# EAGLE design pentawallMini (EAGLE 5.11)
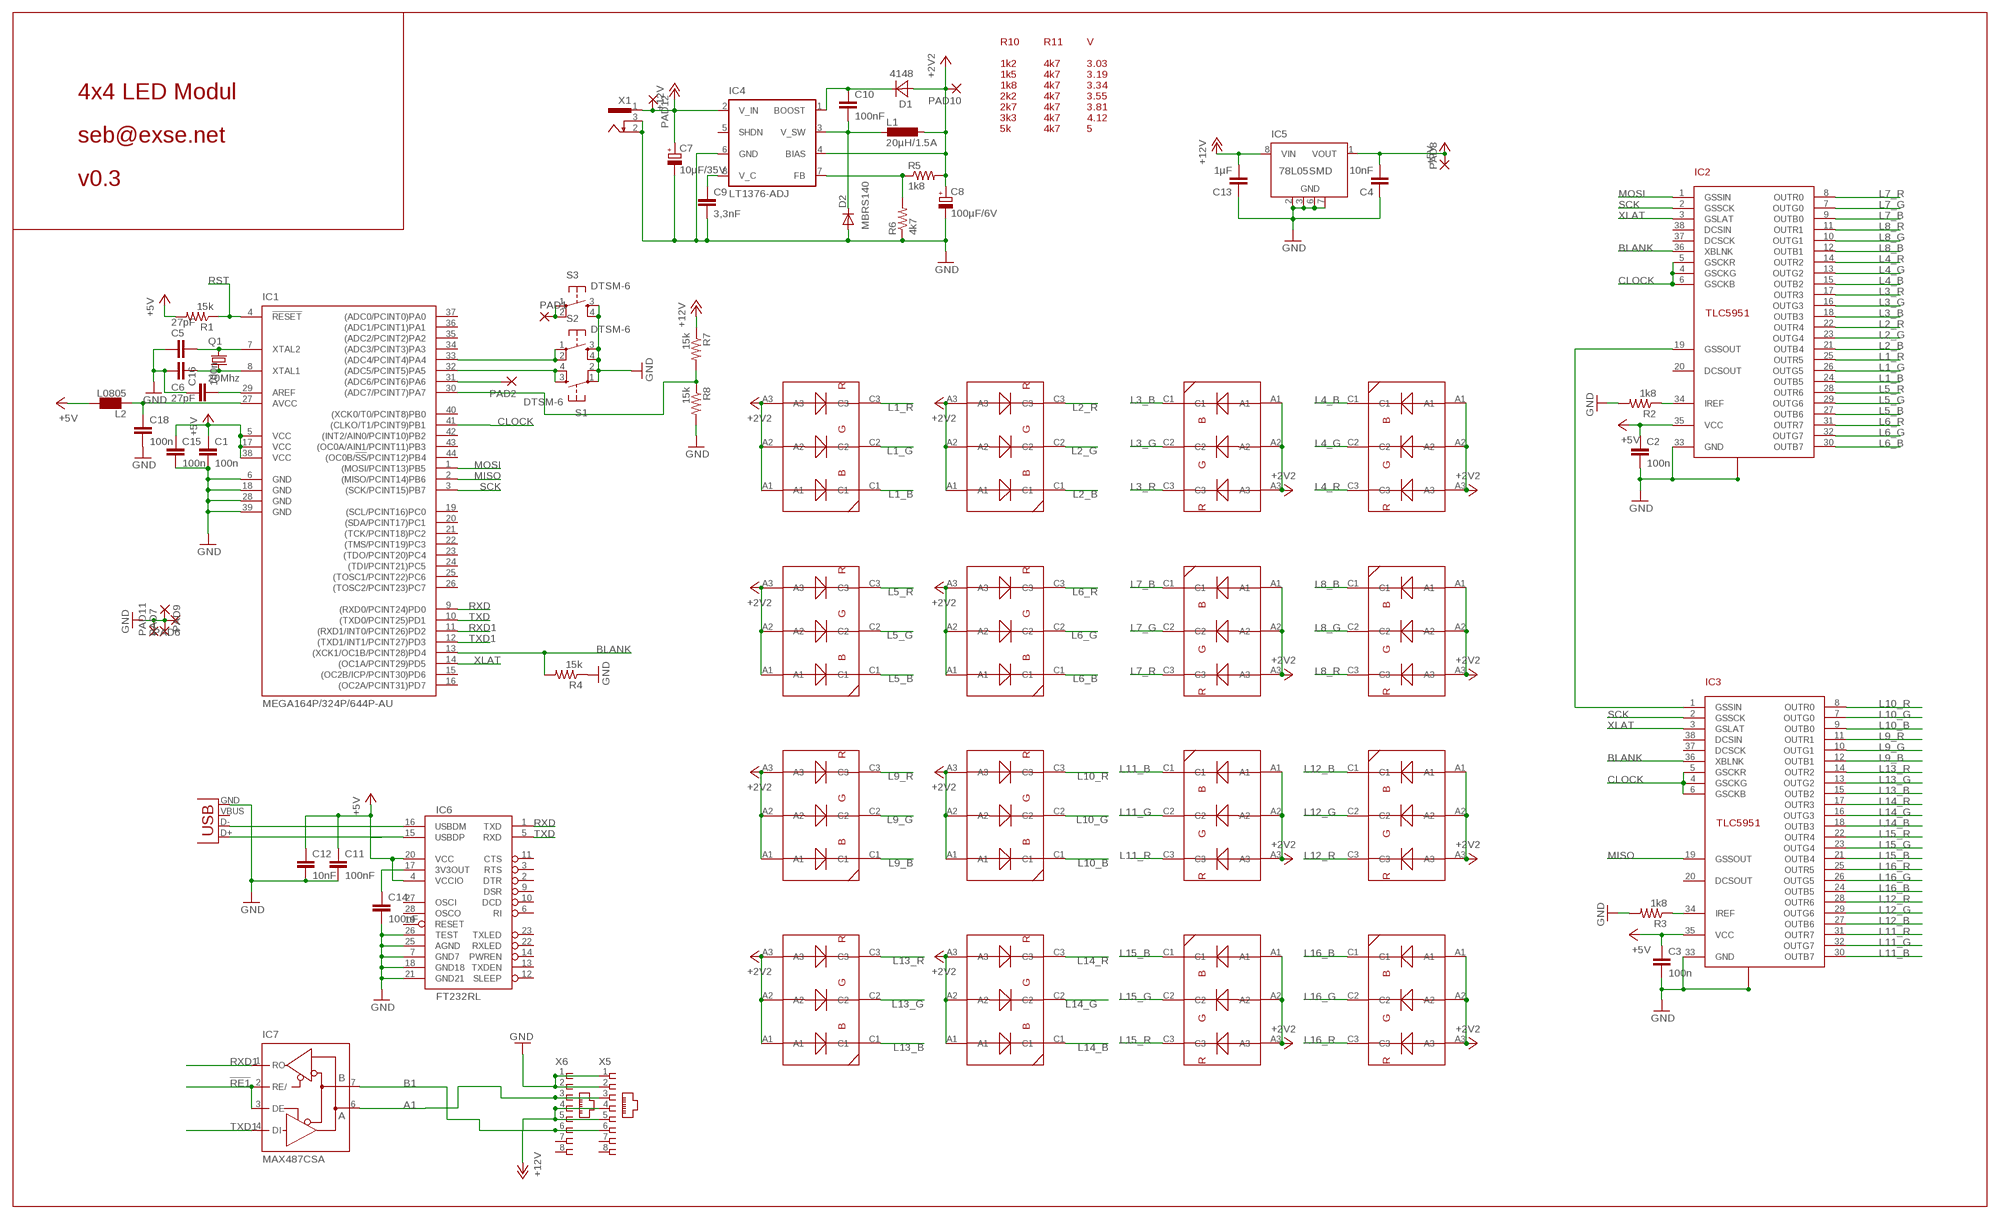
[diagram p0: schematic, sheet 1]

## Parts
C1  100n  CAP0805  [0805]
C2  100n  CAP0805  [0805]
C3  100n  CAP0805  [0805]
C4  10nF  CAP0805  [0805]
C5  27pF  CAP0805  [0805]
C6  27pF  CAP0805  [0805]
C7  10µF/35V  CPOL-EUSMCD  [SMC_D]
C8  100µF/6V  CPOL-EUSMCD  [SMC_D]
C9  3,3nF  CAP0805  [0805]
C10  100nF  CAP0805  [0805]
C11  100nF  CAP0805  [0805]
C12  10nF  CAP0805  [0805]
C13  1µF  CAP0805  [0805]
C14  100nF  CAP0805  [0805]
C15  100n  CAP0805  [0805]
C16  100n  CAP0805  [0805]
C18  100n  CAP0805  [0805]
D1  4148  DIODE_0805  [DIODE_0805]
D2  MBRS140  DIODE-SMB  [SMB]
IC1  MEGA164P/324P/644P-AU  [TQFP44]
IC2  TLC5951  [POWERPAD38]
IC3  TLC5951  [POWERPAD38]
IC4  LT1376-ADJ  LT1376  [SO-08]
IC5  78L05SMD  [SO08]
IC6  FT232RL  FT232RLSSOP  [SSOP28DB]
IC7  MAX487CSA  MAX481CSA  [SO08]
L1  20µH/1.5A  DO3316P  [DO3316P]
L2  L0805  [0805]
PAD1  SMD2  [SMD1,27-2,54]
PAD2  SMD2  [SMD1,27-2,54]
PAD6  SMD2  [SMD1,27-2,54]
PAD7  SMD2  [SMD1,27-2,54]
PAD8  SMD2  [SMD1,27-2,54]
PAD9  SMD2  [SMD1,27-2,54]
PAD10  SMD2  [SMD1,27-2,54]
PAD11  SMD2  [SMD1,27-2,54]
PAD12  SMD2  [SMD1,27-2,54]
Q1  20Mhz  X22-OSCILLATOR  [X22]
R1  15k  RESISTOR  [0805]
R2  1k8  RESISTOR  [0805]
R3  1k8  RESISTOR  [0805]
R4  15k  RESISTOR  [0805]
R5  1k8  RESISTOR  [0805]
R6  4k7  RESISTOR  [0805]
R7  15k  RESISTOR  [0805]
R8  15k  RESISTOR  [0805]
S1  DTSM-6  [DTSM-6]
S2  DTSM-6  [DTSM-6]
S3  DTSM-6  [DTSM-6]
U$1  OSRAM_LRTB_GFTG  OSRAM_LRTB_GFTGSMALL  [PLCC-6_SMALL]
U$2  OSRAM_LRTB_GFTG  OSRAM_LRTB_GFTGSMALL  [PLCC-6_SMALL]
U$3  OSRAM_LRTB_GFTG  OSRAM_LRTB_GFTGSMALL  [PLCC-6_SMALL]
U$4  OSRAM_LRTB_GFTG  OSRAM_LRTB_GFTGSMALL  [PLCC-6_SMALL]
U$5  OSRAM_LRTB_GFTG  OSRAM_LRTB_GFTGSMALL  [PLCC-6_SMALL]
U$6  OSRAM_LRTB_GFTG  OSRAM_LRTB_GFTGSMALL  [PLCC-6_SMALL]
U$7  OSRAM_LRTB_GFTG  OSRAM_LRTB_GFTGSMALL  [PLCC-6_SMALL]
U$8  OSRAM_LRTB_GFTG  OSRAM_LRTB_GFTGSMALL  [PLCC-6_SMALL]
U$9  OSRAM_LRTB_GFTG  OSRAM_LRTB_GFTGSMALL  [PLCC-6_SMALL]
U$10  OSRAM_LRTB_GFTG  OSRAM_LRTB_GFTGSMALL  [PLCC-6_SMALL]
U$11  OSRAM_LRTB_GFTG  OSRAM_LRTB_GFTGSMALL  [PLCC-6_SMALL]
U$12  OSRAM_LRTB_GFTG  OSRAM_LRTB_GFTGSMALL  [PLCC-6_SMALL]
U$13  OSRAM_LRTB_GFTG  OSRAM_LRTB_GFTGSMALL  [PLCC-6_SMALL]
U$14  OSRAM_LRTB_GFTG  OSRAM_LRTB_GFTGSMALL  [PLCC-6_SMALL]
U$15  OSRAM_LRTB_GFTG  OSRAM_LRTB_GFTGSMALL  [PLCC-6_SMALL]
U$16  OSRAM_LRTB_GFTG  OSRAM_LRTB_GFTGSMALL  [PLCC-6_SMALL]
X1  733980-62  [733980-62]
X2  USB-SMD-NS  [USB-MINIB-NOSTOP]
X5  RJ45-8L-B  [RJ45-NO-SHIELD]
X6  RJ45-8L-B  [RJ45-NO-SHIELD]

## Nets
!RE1: IC7.2(RE/) IC7.3(DE)
+12V: C7.+ C13.2 IC4.2(V_IN) IC5.8(VIN) PAD12.1(P) R7.1 X1.1
+24V: X5.4 X5.5 X6.4 X6.5 ; supply symbol labelled +12V
A1: IC7.6(A) X5.3 X6.3
B1: IC7.7(B) X5.6 X6.6
BLANK: IC1.13((XCK1/OC1B/PCINT28)PD4) IC2.36(XBLNK) IC3.36(XBLNK) R4.2
CLOCK: IC1.41((CLKO/T1/PCINT9)PB1) IC2.4(GSCKG) IC2.5(GSCKR) IC2.6(GSCKB) IC3.4(GSCKG) IC3.5(GSCKR) IC3.6(GSCKB)
DVCC: C1.1 C2.1 C3.1 C4.2 C11.1 C12.1 C15.1 IC1.5(VCC) IC1.17(VCC) IC1.38(VCC) IC2.35(VCC) IC3.35(VCC) IC5.1(VOUT) IC6.4(VCCIO) IC6.20(VCC) L2.1 PAD8.1(P) R1.2 ; supply symbol labelled +5V
GND: C1.2 C2.2 C3.2 C4.1 C5.1 C6.1 C7.- C8.- C9.2 C11.2 C12.2 C13.1 C14.2 C15.2 C16.1 C18.2 D2.A IC1.6(GND) IC1.18(GND) IC1.28(GND) IC1.39(GND) IC2.33(GND) IC2.FND@10(GND) IC2.GND IC2.GND@1(GND) IC2.GND@2(GND) IC2.GND@3(GND) IC2.GND@4(GND) IC2.GND@5(GND) IC2.GND@6(GND) IC2.GND@7(GND) IC2.GND@8(GND) IC2.GND@9(GND) IC2.GND@11(GND) IC2.GND@12(GND) IC2.GND@13(GND) IC2.GND@14(GND) IC2.GND@15(GND) IC2.GND@16(GND) IC2.GND@17(GND) IC2.GND@18(GND) IC2.GND@19(GND) IC2.GND@20(GND) IC2.GND@21(GND) IC2.GND@22(GND) IC2.GND@23(GND) IC2.GND@24(GND) IC2.GND@25(GND) IC2.GND@26(GND) IC2.GND@27(GND) IC2.GND@28(GND) IC2.GND@29(GND) IC2.GND@30(GND) IC2.GND@31(GND) IC2.GND@32(GND) IC2.GND@33(GND) IC2.GND@34(GND) IC2.GND@35(GND) IC2.GND@36(GND) IC2.GND@37(GND) IC2.GND@38(GND) IC2.GND@39(GND) IC2.GND@40(GND) IC2.GND@41(GND) IC3.33(GND) IC3.FND@10(GND) IC3.GND IC3.GND@1(GND) IC3.GND@2(GND) IC3.GND@3(GND) IC3.GND@4(GND) IC3.GND@5(GND) IC3.GND@6(GND) IC3.GND@7(GND) IC3.GND@8(GND) IC3.GND@9(GND) IC3.GND@11(GND) IC3.GND@12(GND) IC3.GND@13(GND) IC3.GND@14(GND) IC3.GND@15(GND) IC3.GND@16(GND) IC3.GND@17(GND) IC3.GND@18(GND) IC3.GND@19(GND) IC3.GND@20(GND) IC3.GND@21(GND) IC3.GND@22(GND) IC3.GND@23(GND) IC3.GND@24(GND) IC3.GND@25(GND) IC3.GND@26(GND) IC3.GND@27(GND) IC3.GND@28(GND) IC3.GND@29(GND) IC3.GND@30(GND) IC3.GND@31(GND) IC3.GND@32(GND) IC3.GND@33(GND) IC3.GND@34(GND) IC3.GND@35(GND) IC3.GND@36(GND) IC3.GND@37(GND) IC3.GND@38(GND) IC3.GND@39(GND) IC3.GND@40(GND) IC3.GND@41(GND) IC4.6(GND) IC5.2(GND) IC5.3(GND) IC5.6(GND) IC5.7(GND) IC6.7(GND7) IC6.18(GND18) IC6.21(GND21) IC6.25(AGND) IC6.26(TEST) PAD6.1(P) PAD7.1(P) PAD9.1(P) PAD11.1(P) R2.2 R3.2 R4.1 R6.1 R8.2 S1.1 S1.2 S2.3 S2.4 S3.3 S3.4 X1.2 X1.3 X2.GND X5.1 X5.2 X6.1 X6.2
L1_B: IC2.24(OUTB5) U$8.C1
L1_G: IC2.26(OUTG5) U$8.C2
L1_R: IC2.25(OUTR5) U$8.C3
L2_B: IC2.21(OUTB4) U$7.C1
L2_G: IC2.23(OUTG4) U$7.C2
L2_R: IC2.22(OUTR4) U$7.C3
L3_B: IC2.18(OUTB3) U$1.C1
L3_G: IC2.16(OUTG3) U$1.C2
L3_R: IC2.17(OUTR3) U$1.C3
L4_B: IC2.15(OUTB2) U$3.C1
L4_G: IC2.13(OUTG2) U$3.C2
L4_R: IC2.14(OUTR2) U$3.C3
L5_B: IC2.27(OUTB6) U$2.C1
L5_G: IC2.29(OUTG6) U$2.C2
L5_R: IC2.28(OUTR6) U$2.C3
L6_B: IC2.30(OUTB7) U$10.C1
L6_G: IC2.32(OUTG7) U$10.C2
L6_R: IC2.31(OUTR7) U$10.C3
L7_B: IC2.9(OUTB0) U$6.C1
L7_G: IC2.7(OUTG0) U$6.C2
L7_R: IC2.8(OUTR0) U$6.C3
L8_B: IC2.12(OUTB1) U$9.C1
L8_G: IC2.10(OUTG1) U$9.C2
L8_R: IC2.11(OUTR1) U$9.C3
L9_B: IC3.12(OUTB1) U$14.C1
L9_G: IC3.10(OUTG1) U$14.C2
L9_R: IC3.11(OUTR1) U$14.C3
L10_B: IC3.9(OUTB0) U$13.C1
L10_G: IC3.7(OUTG0) U$13.C2
L10_R: IC3.8(OUTR0) U$13.C3
L11_B: IC3.30(OUTB7) U$12.C1
L11_G: IC3.32(OUTG7) U$12.C2
L11_R: IC3.31(OUTR7) U$12.C3
L12_B: IC3.27(OUTB6) U$5.C1
L12_G: IC3.29(OUTG6) U$5.C2
L12_R: IC3.28(OUTR6) U$5.C3
L13_B: IC3.15(OUTB2) U$11.C1
L13_G: IC3.13(OUTG2) U$11.C2
L13_R: IC3.14(OUTR2) U$11.C3
L14_B: IC3.18(OUTB3) U$15.C1
L14_G: IC3.16(OUTG3) U$15.C2
L14_R: IC3.17(OUTR3) U$15.C3
L15_B: IC3.21(OUTB4) U$16.C1
L15_G: IC3.23(OUTG4) U$16.C2
L15_R: IC3.22(OUTR4) U$16.C3
L16_B: IC3.24(OUTB5) U$4.C1
L16_G: IC3.26(OUTG5) U$4.C2
L16_R: IC3.25(OUTR5) U$4.C3
MISO: IC1.2((MISO/PCINT14)PB6) IC3.19(GSSOUT)
MOSI: IC1.1((MOSI/PCINT13)PB5) IC2.1(GSSIN)
N$1: IC6.16(USBDM) X2.D-
N$2: IC1.33((ADC4/PCINT4)PA4) S2.1 S2.2
N$3: IC6.15(USBDP) X2.D+
N$4: C16.2 IC1.29(AREF)
N$5: C18.1 IC1.27(AVCC) L2.2
N$7: IC1.32((ADC5/PCINT5)PA5) S1.3 S1.4
N$9: IC2.19(GSSOUT) IC3.1(GSSIN)
N$10: IC4.7(FB) R5.1 R6.2
N$11: IC3.34(IREF) R3.1
N$12: IC2.34(IREF) R2.1
N$14: PAD1.1(P) S3.1 S3.2
N$15: IC1.31((ADC6/PCINT6)PA6) PAD2.1(P)
N$16: IC1.30((ADC7/PCINT7)PA7) R7.2 R8.1
N$29: C14.1 IC6.17(3V3OUT)
N$30: C5.2 IC1.7(XTAL2) Q1.3
N$32: C6.2 IC1.8(XTAL1) Q1.1
N$56: C9.1 IC4.8(V_C)
N$57: C10.2 D2.C IC4.3(V_SW) L1.1
N$58: C10.1 D1.1(C) IC4.1(BOOST)
RST: IC1.4(!RESET) R1.1
RXD: IC1.9((RXD0/PCINT24)PD0) IC6.1(TXD)
RXD1: IC1.11((RXD1/INT0/PCINT26)PD2) IC7.1(RO)
SCK: IC1.3((SCK/PCINT15)PB7) IC2.2(GSSCK) IC3.2(GSSCK)
TXD: IC1.10((TXD0/PCINT25)PD1) IC6.5(RXD)
TXD1: IC1.12((TXD1/INT1/PCINT27)PD3) IC7.4(DI)
VCC_R: C8.+ D1.2(A) IC4.4(BIAS) L1.2 PAD10.1(P) R5.2 U$1.A1 U$1.A2 U$1.A3 U$2.A1 U$2.A2 U$2.A3 U$3.A1 U$3.A2 U$3.A3 U$4.A1 U$4.A2 U$4.A3 U$5.A1 U$5.A2 U$5.A3 U$6.A1 U$6.A2 U$6.A3 U$7.A1 U$7.A2 U$7.A3 U$8.A1 U$8.A2 U$8.A3 U$9.A1 U$9.A2 U$9.A3 U$10.A1 U$10.A2 U$10.A3 U$11.A1 U$11.A2 U$11.A3 U$12.A1 U$12.A2 U$12.A3 U$13.A1 U$13.A2 U$13.A3 U$14.A1 U$14.A2 U$14.A3 U$15.A1 U$15.A2 U$15.A3 U$16.A1 U$16.A2 U$16.A3 ; supply symbol labelled +2V2
XLAT: IC1.14((OC1A/PCINT29)PD5) IC2.3(GSLAT) IC3.3(GSLAT)
Unconnected: IC1.15((OC2B/ICP/PCINT30)PD6) IC1.16((OC2A/PCINT31)PD7) IC1.19((SCL/PCINT16)PC0) IC1.20((SDA/PCINT17)PC1) IC1.21((TCK/PCINT18)PC2) IC1.22((TMS/PCINT19)PC3) IC1.23((TDO/PCINT20)PC4) IC1.24((TDI/PCINT21)PC5) IC1.25((TOSC1/PCINT22)PC6) IC1.26((TOSC2/PCINT23)PC7) IC1.34((ADC3/PCINT3)PA3) IC1.35((ADC2/PCINT2)PA2) IC1.36((ADC1/PCINT1)PA1) IC1.37((ADC0/PCINT0)PA0) IC1.40((XCK0/T0/PCINT8)PB0) IC1.42((INT2/AIN0/PCINT10)PB2) IC1.43((OC0A/AIN1/PCINT11)PB3) IC1.44((OC0B/!SS!/PCINT12)PB4) IC2.20(DCSOUT) IC2.37(DCSCK) IC2.38(DCSIN) IC3.20(DCSOUT) IC3.37(DCSCK) IC3.38(DCSIN) IC4.5(SHDN) IC5.4(NC) IC5.5(NC) IC6.2(DTR) IC6.3(RTS) IC6.6(RI) IC6.9(DSR) IC6.10(DCD) IC6.11(CTS) IC6.12(SLEEP) IC6.13(TXDEN) IC6.14(PWREN) IC6.19(RESET) IC6.22(RXLED) IC6.23(TXLED) IC6.27(OSCI) IC6.28(OSCO) X2.VBUS X5.7 X5.8 X6.7 X6.8

## Notes on the sheet
- R10 | R11 | V
- 1k2 | 4k7 | 3.03
- 1k5 | 4k7 | 3.19
- 1k8 | 4k7 | 3.34
- 4x4 LED Modul | 2k2 | 4k7 | 3.55
- 2k7 | 4k7 | 3.81
- 3k3 | 4k7 | 4.12
- 5k | 4k7 | 5
- seb@exse.net
- v0.3

## Power pins joined to a net without a drawn wire
GND: IC7.5(GND)
VCC: IC7.8(VCC)

## Library data of the parts
C1-C6 C9-C16 C18 = SparkFun:CAP: Capacitor Standard 0603 ceramic capacitor, and 0.1" leaded capacitor.
C7 C8 = resistor:CPOL-EU: POLARIZED CAPACITOR, European symbol
D1 = seb:DIODE_0805
D2 = diode:DIODE-: DIODE
IC1 = avr-7:MEGA164P/324P/644P-AU
IC2 IC3 = seb:TLC5951
IC4 = v-reg:LT1376
IC5 = linear:78L*SMD: Positive VOLTAGE REGULATOR
IC6 = SparkFun:FT232RL: USB UART FT232RL 4th Generation USB UART (USB <-> Serial) Controller. Spark Fun Electronics SKU : COM-00650
IC7 = maxim:MAX481CSA: RS485 TRANSEIVER
L1 = inductor-coilcraft:DO3316P: COILCRAFT; OC_FARNELL: unknown; OC_NEWARK: unknown
L2 = seb:L0805
PAD1 PAD2 PAD6-PAD12 = wirepad:SMD2: SMD PAD
Q1 = seb:X22-OSCILLATOR
R1-R8 = SparkFun:RESISTOR: Resistor Basic schematic elements and footprints for 0603, 1206, and PTH 1/10th watt (small) resistors.
S1-S3 = switch-tact:DTSM-6
U$1-U$16 = seb:OSRAM_LRTB_GFTG
X1 = con-conrad:73398?: FEMALE PRINT CONNECTOR Niedervolt-Steckverbinder Distributor Conrad
X2 = SparkFun:USB: USB Connectors USB-B-PTH is fully proven SKU : PRT-00139 USB-miniB is fully proven SKU : PRT-00587 USB-A-PCB is untested. USB-A-H is throughly reviewed, but untested. Spark Fun Electronics SKU : PRT-00437 USB-B-SMT is throughly reviewed, but untested. Needs silkscreen touching up. USB-A-S has not been used/tested USB-MB-H has not been used/tested
X5 X6 = con-tycoelectronics:RJ45: CORCOM Modular RJ Jacks No Shield Source: www.tycoelectronics.com .. ENG_DS_1654001_1099_RJ_L_0507.pdf; MF: TYCO ELECTRONICS; MPN: RJ45-8L-B; OC_FARNELL: 1279843; OC_NEWARK: 52K4445

## Board
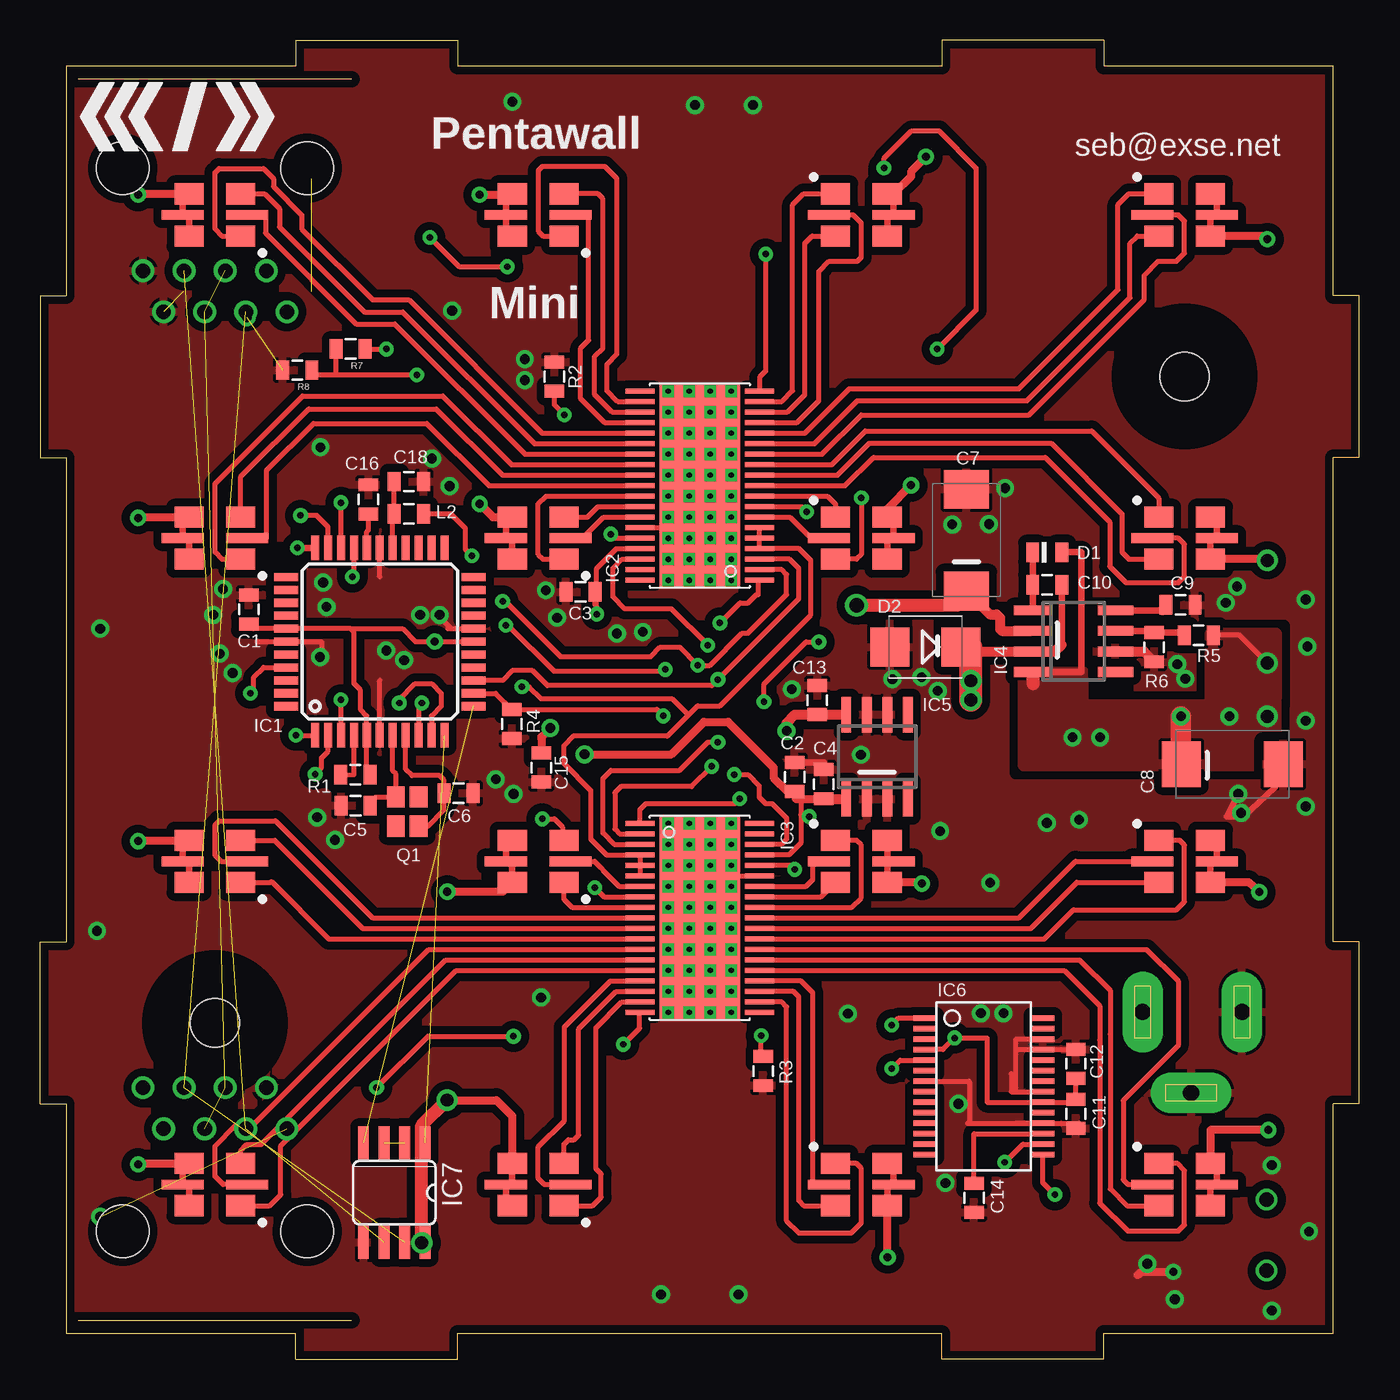
[diagram p1: board, top side]
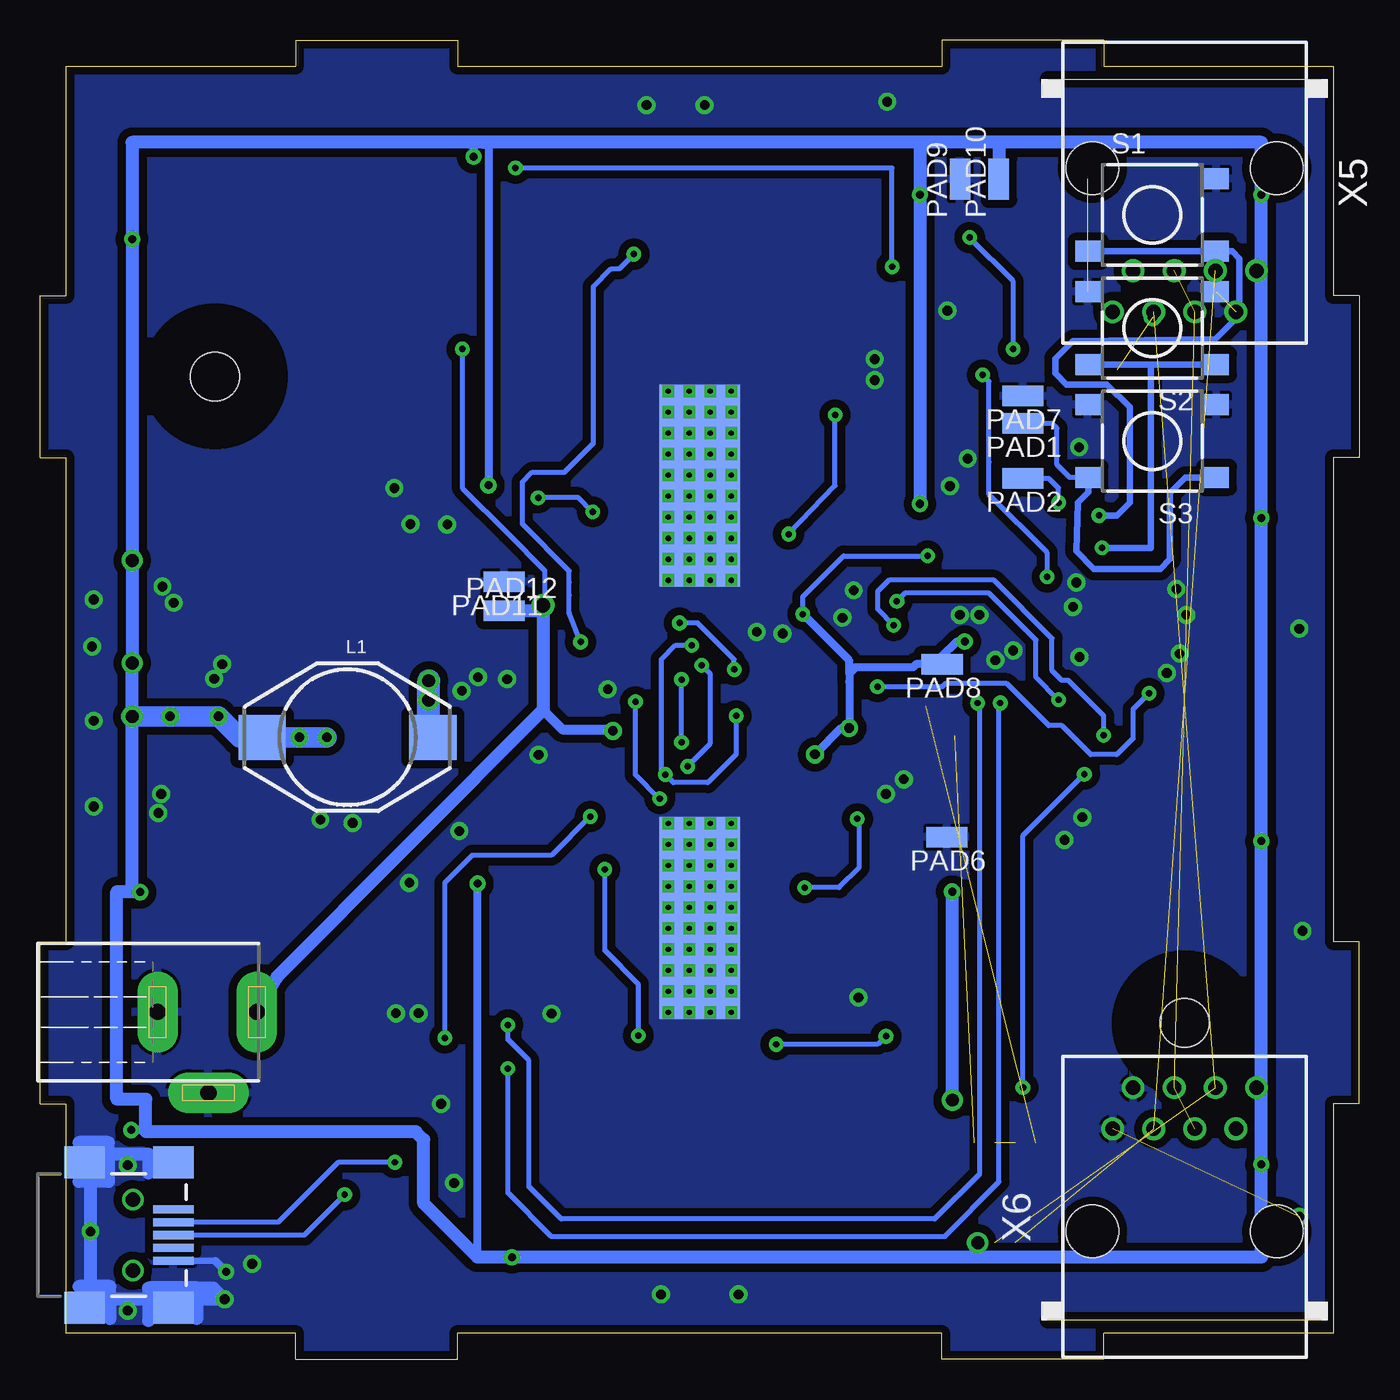
[diagram p2: board, bottom side, seen from below]

Size 81.6 x 81.6 mm. Coordinates in mm from the lower left corner, seen from the top.
Outline: 80,1.6 80,15.8 81.6,15.8 81.6,25.8 80,25.8 80,55.8 81.6,55.8 81.6,65.8 80,65.8 80,80 65.8,80 65.8,81.6 55.8,81.6 55.8,80 25.8,80 25.8,81.6 15.8,81.6 15.8,80 1.6,80 1.6,65.8 0,65.8 0,55.8 1.6,55.8 1.6,25.8 0,25.8 0,15.8 1.6,15.8 1.6,1.6 15.8,1.6 15.8,0 25.8,0 25.8,1.6 55.8,1.6 55.8,0 65.8,0 65.8,1.6 80,1.6
Copper layers (1*16): Top 0.035mm / dielectric 1.5mm / Bottom 0.035mm
Design rules "PCBCart-Standard *": minimum track width 12mil, minimum drill 0.3mm, track to track 13mil, track to pad 12mil, pad to pad 9mil, via to via 13mil, smd to smd 8mil, copper to edge 20mil, drill to drill 8mil, minimum pad ring 8mil, minimum via ring 10mil, stop-mask expansion 2mil, vias tented up to drill 2mm, thermal gap 8mil
Holes 3 mm at 10.8,20.8 70.8,60.8
tRestrict: area 69.8,59.8 to 71.8,61.8; area 9.8,19.8 to 11.8,21.8
bRestrict: area 69.8,59.8 to 71.8,61.8; area 9.8,19.8 to 11.8,21.8

### Footprints (pad centres in the part's own frame; a part is rotated, then mirrored left to right if it is on the bottom)
0805 = smd 0.8 x 1.2: 1 -0.9,0; 2 0.9,0
SMC_D = smd 2.4 x 2.8: + -3.15,0; - 3.15,0
DIODE_0805 = smd 0.8 x 1.2: 1 -0.9,0; 2 0.9,0
SMB = smd 2.4 x 2.4: A 2.2,0; C -2.2,0
TQFP44 = smd 1.5 x 0.5: 1 -5.8,4; 2 -5.8,3.2; 3 -5.8,2.4; 4 -5.8,1.6; 5 -5.8,0.8; 6 -5.8,0; 7 -5.8,-0.8; 8 -5.8,-1.6; 9 -5.8,-2.4; 10 -5.8,-3.2; 11 -5.8,-4; 23 5.8,-4; 24 5.8,-3.2; 25 5.8,-2.4; 26 5.8,-1.6; 27 5.8,-0.8; 28 5.8,0; 29 5.8,0.8; 30 5.8,1.6; 31 5.8,2.4; 32 5.8,3.2; 33 5.8,4 | smd 0.5 x 1.5: 12 -4,-5.8; 13 -3.2,-5.8; 14 -2.4,-5.8; 15 -1.6,-5.8; 16 -0.8,-5.8; 17 0,-5.8; 18 0.8,-5.8; 19 1.6,-5.8; 20 2.4,-5.8; 21 3.2,-5.8; 22 4,-5.8; 34 4,5.8; 35 3.2,5.8; 36 2.4,5.8; 37 1.6,5.8; 38 0.8,5.8; 39 0,5.8; 40 -0.8,5.8; 41 -1.6,5.8; 42 -2.4,5.8; 43 -3.2,5.8; 44 -4,5.8
POWERPAD38 = smd 0.305 x 1.8: 1 -5.85,-3.7; 2 -5.2,-3.7; 3 -4.55,-3.7; 4 -3.9,-3.7; 5 -3.25,-3.7; 6 -2.6,-3.7; 7 -1.95,-3.7; 8 -1.3,-3.7; 9 -0.65,-3.7; 10 0,-3.7; 11 0.65,-3.7; 12 1.3,-3.7; 13 1.95,-3.7; 14 2.6,-3.7; 15 3.25,-3.7; 16 3.9,-3.7; 17 4.55,-3.7; 18 5.2,-3.7; 19 5.85,-3.7; 20 5.85,3.7; 21 5.2,3.7; 22 4.55,3.7; 23 3.9,3.7; 24 3.25,3.7; 25 2.6,3.7; 26 1.95,3.7; 27 1.3,3.7; 28 0.65,3.7; 29 0,3.7; 30 -0.65,3.7; 31 -1.3,3.7; 32 -1.95,3.7; 33 -2.6,3.7; 34 -3.25,3.7; 35 -3.9,3.7; 36 -4.55,3.7; 37 -5.2,3.7; 38 -5.85,3.7 | drill 0.33 square: FND@10 5.85,1.95; GND@1 -5.85,1.95; GND@2 -4.55,1.95; GND@3 -3.25,1.95; GND@4 -1.95,1.95; GND@5 -0.65,1.95; GND@6 0.65,1.95; GND@7 1.95,1.95; GND@8 3.25,1.95; GND@9 4.55,1.95; GND@11 -5.85,0.65; GND@12 -4.55,0.65; GND@13 -3.25,0.65; GND@14 -1.95,0.65; GND@15 -0.65,0.65; GND@16 0.65,0.65; GND@17 1.95,0.65; GND@18 3.25,0.65; GND@19 4.55,0.65; GND@20 5.85,0.65; GND@21 -5.85,-0.65; GND@22 -4.55,-0.65; GND@23 -3.25,-0.65; GND@24 -1.95,-0.65; GND@25 -0.65,-0.65; GND@26 0.65,-0.65; GND@27 1.95,-0.65; GND@28 3.25,-0.65; GND@29 4.55,-0.65; GND@30 5.85,-0.65; GND@31 -5.85,-1.95; GND@32 -4.55,-1.95; GND@33 -3.25,-1.95; GND@34 -1.95,-1.95; GND@35 -0.65,-1.95; GND@36 0.65,-1.95; GND@37 1.95,-1.95; GND@38 3.25,-1.95; GND@39 4.55,-1.95; GND@40 5.85,-1.95 | smd 12.5 x 5: GND 0,0 | smd 12.5 x 5 bottom: GND@41 0,0
SO-08 = smd 0.6 x 2.2: 1 -1.905,-2.6; 2 -0.635,-2.6; 3 0.635,-2.6; 4 1.905,-2.6; 5 1.905,2.6; 6 0.635,2.6; 7 -0.635,2.6; 8 -1.905,2.6
SO08 = smd 0.6 x 2.2: 1 -1.905,-2.6; 2 -0.635,-2.6; 3 0.635,-2.6; 4 1.905,-2.6; 5 1.905,2.6; 6 0.635,2.6; 7 -0.635,2.6; 8 -1.905,2.6
SSOP28DB = smd 0.348 x 1.397: 1 -4.225,-3.656; 2 -3.575,-3.656; 3 -2.925,-3.656; 4 -2.275,-3.656; 5 -1.625,-3.656; 6 -0.975,-3.656; 7 -0.325,-3.656; 8 0.325,-3.656; 9 0.975,-3.656; 10 1.625,-3.656; 11 2.275,-3.656; 12 2.925,-3.656; 13 3.575,-3.656; 14 4.225,-3.656; 15 4.225,3.656; 16 3.575,3.656; 17 2.925,3.656; 18 2.275,3.656; 19 1.625,3.656; 20 0.975,3.656; 21 0.325,3.656; 22 -0.325,3.656; 23 -0.975,3.656; 24 -1.625,3.656; 25 -2.275,3.656; 26 -2.925,3.656; 27 -3.575,3.656; 28 -4.225,3.656
SO08' = smd 0.66 x 2.032: 1 -1.905,-3.073; 2 -0.635,-3.073; 3 0.635,-3.073; 4 1.905,-3.073; 5 1.905,3.073; 6 0.635,3.073; 7 -0.635,3.073; 8 -1.905,3.073
DO3316P = smd 2.92 x 2.79: 1 -5.28,0; 2 5.28,0
SMD1,27-2,54 = smd 1.27 x 2.54: 1 0,0
X22 = smd 1.3 x 1.1: 1 0.9,0.7; 2 -0.9,0.7; 3 -0.9,-0.7; 4 0.9,-0.7
DTSM-6 = smd 1.55 x 1.3: 1 -3.975,2.25; 2 3.975,2.25; 3 -3.975,-2.25; 4 3.975,-2.25
PLCC-6_SMALL = smd 1.3 x 1.8: A1 1.3,-1.6; A3 -1.3,-1.6; C1 1.3,1.6; C3 -1.3,1.6 | smd 0.6 x 2.6: A2 0,-2; C2 0,2
733980-62 = drill 1 pad 2.5 long: 1 0,8.57; 2 0,2.42; 3 5,5.57
USB-MINIB-NOSTOP = smd 2.5 x 0.5: D+ 2.5,0; D- 2.5,0.8; GND 2.5,-1.6; ID 2.5,-0.8; VBUS 2.5,1.6 | smd 2.5 x 2: G1 -3,-4.5; G2 -3,4.5; G3 2.5,4.5; G4 2.5,-4.5 | drill 0.9 pad 0.8 round: H1 0,2.2 | drill 0.9 pad 0.787 round: H2 0,-2.2
RJ45-NO-SHIELD = drill 0.9 pad 1.4 round: 1 -4.445,6.35; 2 -3.175,8.89; 3 -1.905,6.35; 4 -0.635,8.89; 5 0.635,6.35; 6 1.905,8.89; 7 3.175,6.35; 8 4.445,8.89 | hole 3.251: -5.715,0; 5.715,0

### Placement (x,y rotation side)
C1  12.9,46.39 90 top
C2  46.67,36.02 90 top
C3  33.42,47.47 180 top
C4  48.47,35.57 270 top
C5  19.5,34.25 0 top
C6  25.88,35.02 180 top
C7  57.3,50.67 90 top
C8  73.75,36.81 0 top
C9  70.55,46.67 0 top
C10  62.3,47.92 0 top
C11  64.08,15.18 270 top
C12  64.08,18.28 90 top
C13  48.07,40.77 270 top
C14  57.77,9.98 270 top
C15  31,36.6 270 top
C16  20.3,53.2 270 top
C18  22.8,54.3 0 top
D1  62.3,49.92 0 top
D2  54.76,44.06 180 top
IC1  21,44.4 90 top
IC2  40.8,54.05 90 top
IC3  40.8,27.3 270 top
IC4  63.92,44.42 270 top
IC5  51.77,37.27 0 top
IC6  58.38,16.88 270 top
IC7  MAX487CSA  [SO08']  21.9,10.3 180 top
L1  62.6,38.47 180 bottom
L2  22.8,52.3 180 top
PAD1  20.8,57.9 90 bottom
PAD2  20.8,54.5 90 bottom
PAD6  25.5,32.3 90 bottom
PAD7  20.8,59.6 90 bottom
PAD8  25.8,43 90 bottom
PAD9  24.7,73 0 bottom
PAD10  22.3,73 0 bottom
PAD11  52.9,48.1 90 bottom
PAD12  52.9,46.3 270 bottom
Q1  22.7,33.88 270 top
R1  19.49,36.16 0 top
R2  31.8,60.8 90 top
R3  44.72,17.82 270 top
R4  29.18,39.3 90 top
R5  71.67,44.8 0 top
R6  68.92,44.05 90 top
R7  19.2,62.5 180 top
R8  15.9,61.2 180 top
S1  12.8,70.8 0 bottom
S2  12.8,63.8 180 bottom
S3  12.8,56.8 180 bottom
U$1  50.8,70.8 90 top
U$2  10.8,50.8 270 top
U$3  70.8,70.8 90 top
U$4  70.8,10.8 90 top
U$5  70.8,30.8 90 top
U$6  50.8,50.8 90 top
U$7  30.8,70.8 270 top
U$8  10.8,70.8 270 top
U$9  70.8,50.8 90 top
U$10  30.8,50.8 270 top
U$11  10.8,10.8 270 top
U$12  50.8,30.8 90 top
U$13  30.8,30.8 270 top
U$14  10.8,30.8 270 top
U$15  30.8,10.8 270 top
U$16  50.8,10.8 90 top
X1  76.77,21.48 270 bottom
X2  75.88,7.67 0 bottom
X5  10.8,73.7 180 bottom
X6  10.8,7.9 0 bottom

### Tracks (layer width: path | path; a pad name or v marks a point on that pad's centre or on a via)
!RE1  (1 unrouted)
+12V  (via drill 0.4, 0.6, 0.9)
  Top 0.305: R7.1 v21.4,62.5 | v24.1,69.4 25,68.5 25.9,67.6 v28.9,67.6 | v52.2,73.7 52.2,74.3 53.9,76 55.6,76 57.9,73.7 57.9,64.9 v55.5,62.5
  Top 0.61: IC4.2 59.49,45.06 59.38,45.17 59.38,45.88 59.17,46.07 58.75,46.07 C7.+ | IC5.8 C13.2 46.67,39.88 46.17,39.38 v46.17,38.88
  Top 0.813: C7.+ 56.72,46.65 v50.5,46.65
  Bottom 0.305: v21.4,62.5 21.4,66.7 v24.1,69.4 | v28.9,67.6 28.9,73.7 50.9,73.7 v52.2,73.7 | v55.5,62.5 55.5,53.9 52.7,51.1 50.4,48.8 50.4,46.75 v50.5,46.65
  Bottom 0.61: v46.17,38.88 46.27,38.97 49.29,38.97 50.5,40.18
  Bottom 0.813: PAD12.1 50.85,46.3 v50.5,46.65 50.5,40.18 67,23.57 X1.1
+24V  (3 unrouted)
A1  (2 unrouted)
B1  (2 unrouted)
BLANK  (via drill 0.4)
  Top 0.305: R4.2 28.78,40.21 | IC2.36 36,49.5 35.42,48.92 35.42,47.17 36.17,46.42 39.05,46.42 v41.3,44.17 | IC3.36 45.85,31.85 46.17,32.17 46.17,33.47 45.27,34.38 44.88,34.38 44.47,34.77 44.47,35.47 43.77,36.17 v42.92,36.17 | R4.2 38.15,40.2 v38.55,39.8 | R4.2 29.15,40.17 | IC1.13 28.18,41.2 R4.2
  Bottom 0.305: v41.3,44.17 42.3,44.17 43.17,43.3 43.17,36.42 v42.92,36.17 42.42,35.67 40.3,35.67 38.55,37.42 v38.55,39.8
CLOCK  (via drill 0.4)
  Top 0.305: IC2.6 IC2.5 IC2.4 46.95,50.15 47.67,49.42 47.67,46.05 42.05,40.42 40.67,40.42 40.1,39.85 | IC3.6 IC3.5 IC3.4 35.02,31.2 34.05,32.17 34.05,35.2 32.38,36.88 32.38,37.95 32.97,38.55 38.8,38.55 40.1,39.85 | 40.1,39.85 39.07,40.88 30.98,40.88 30.25,41.6 v29.8,41.6 | IC1.41 13.8,42.8 13.2,42.2 13.2,41.4 v13,41.2
  Bottom 0.305: v29.8,41.6 25.8,41.6 25.6,41.8 21.8,41.8 19.2,39.2 18.4,39.2 16.6,37.4 15,37.4 14,38.4 14,40.2 v13,41.2
DVCC  (via drill 0.4, 0.5, 0.6)
  Top 0.305: IC3.35 46.32,31.2 47.05,31.93 47.05,33.67 | v31.55,39.05 30.9,38.4 | v34.42,46.1 34.42,46.55 | C3.1 34.32,46.65 34.42,46.55 | IC2.35 35.65,50.15 34.42,48.92 34.42,46.55 | 47.05,33.67 47.05,35.05 C2.1 46.22,35.12 | C12.1 C11.1 64.28,15.9 IC6.20 58.57,15.9 58.57,19.88 v56.57,19.88 55.85,19.15 IC6.4 | v47.57,33.57 47.15,33.57 47.05,33.67 | IC1.17 v24.4,44.4 23.2,44.4 22.4,45.2 19.2,45.2 | C1.1 13.19,45.2 IC1.38 19.2,45.2 | R1.2 20.2,36.75 IC1.5 20.2,39.8 19.8,40.2 19.8,41.4 19.4,41.8 19.4,45 19.2,45.2 | L2.1 25.4,52.3 26.3,51.4 26.3,50.1 v26.7,49.7
  Top 0.406: C2.1 46.72,34.67
  Top 0.5: v33.67,37.42 39.05,37.42 41.05,39.42 42.55,39.42 45.38,36.6 45.38,35.97 46.22,35.12 | 46.72,34.67 C4.2 | C15.1 31,38.5 v31.55,39.05
  Top 0.61: C4.2 IC5.1
  Bottom 0.305: v56.57,19.88 56.57,29.48 54.88,31.18 49.97,31.18 v47.57,33.57 | v26.7,49.7 31.9,49.7 34.42,47.17 v34.42,46.1
  Bottom 0.5: v33.67,37.42 32.05,39.05 v31.55,39.05 31.55,41.9 31.55,42.42 | v24.4,44.4 24.9,44.4 25.9,43.4 25.9,43 | 31.55,42.42 31.18,42.8 27.6,42.8 27.4,43 25.9,43 | 25.9,43 PAD8.1 | v34.42,46.1 31.55,43.22 31.55,42.42
GND  (via drill 0.5, 0.6)  (4 unrouted)
  Top 0.305: 40.82,29.9 IC3.33 | IC2.33 39.42,51.45 | IC6.18 64.28,14.6 C11.2 | IC6.18 60.38,14.6 | 60.38,16.55 IC6.21 | IC6.26 60.38,19.8 60.38,19.15 | 60.38,19.15 IC6.25 62.06,19.18 C12.2 | 60.38,16.55 60.38,19.15 | IC6.18 57.38,14.6 57.38,14.58 57.47,14.58 57.47,17.2 IC6.7 | 60.38,16.55 60.07,16.55 60.07,17.68 | 25.4,45.2 25.2,45.2 | 21,48.4 IC1.28 | 13.4,44.4 IC1.39 17.4,44.4 17.4,43.55 v17.3,43.45 | 25.4,45.2 IC1.18 | 25.4,45.2 24.6,46 | IC1.6 21,42
  Top 0.406: 76.38,35.38 74.47,33.57 73.42,33.57 v74.12,34.97 | C2.2 48.47,36.92 C4.1
  Top 0.5: v70.1,5.4 68.1,5.4 67.9,5.2
  Top 0.61: IC4.6 68.28,43.79 R6.1
  Bottom 0.406: 70.77,6.08 X2.GND
  Bottom 0.5: v70.1,5.4 70.77,6.08
  Bottom 0.813: 71.9,2.5 71.9,4.4 | 71.9,4.4 74.9,4.4 74.9,2.4 | 71.9,4.4 70.9,4.4 v70.2,3.7 77.3,3.7 | 79.2,13.4 77.4,13.4 77.4,12.7 | 79.2,11 77.4,11 77.4,12.7 | 77.4,12.7 74.9,12.7 74.9,11.5 | 78.5,4.5 77.3,4.5 77.3,3.7 | 78.5,4.5 79.2,4.5 | 77.3,3.7 77.3,2.5 | 77.4,12.7 78.5,12.7 78.5,4.5
  other vias: 52.72,42.07 55.52,41.35 74.05,47.8 54.52,42.2 50.77,37.4 17.5,48.05 24.23,55.72 29.98,61.88 17.12,33.52 58.7,51.67 18.23,32.12 29.28,34.97 46.5,41.45 59.7,53.9 56.42,51.65 35.67,44.9 70.85,42.1 70.35,43 29.98,60.57 73.35,46.8 58.2,21.4 59.6,21.4 56.8,15.8 56,10.9 31.28,47.57 58.77,29.48 62.27,33.17 55.67,32.67 49.97,21.38 74.3,33.8 64.28,33.38 11.9,42.45 11.1,43.65 17.7,46.55 25.32,54.02 11.3,47.65 10.7,46.05 21.4,43.85 24.7,46.05 23.5,46.05 22.5,43.25 68.5,5.9 43.2,4 38.4,4 3.7,8.8 3.5,26.5 3.7,45.2 29.2,77.8 40.5,77.6 44.1,77.6 78.3,47 78.4,44.1 78.3,39.5 78.3,34.2 28.18,35.88 12.78,64.47 30.98,22.38 17.32,56.42 25.48,64.88 37.27,45 31.98,45.88 78.5,7.9 76.2,12 76.2,3
  pour Bottom (isolate 0.5): -0.2,-0.2 81.8,-0.4 81.8,82 -0.2,82.2
  pour Top (isolate 0.5, rank 2): 81.8,-0.6 -0.6,-0.2 -0.2,82.2 82.2,81.8
L1_B
  Top 0.305: U$8.C1 11.23,69.5 10.8,69.92 10.8,73.42 11.05,73.67 13.8,73.67 14.43,73.05 14.43,72.55 16.18,70.8 16.18,69.92 20.55,65.55 22.8,65.55 31.05,57.3 IC2.24
L1_G
  Top 0.305: U$8.C2 13.93,70.8 13.93,69.67 19.55,64.05 21.93,64.05 29.98,56 IC2.26
L1_R
  Top 0.305: U$8.C3 13.88,72.1 14.8,71.17 14.8,70.05 20.05,64.8 22.43,64.8 30.57,56.65 IC2.25
L2_B
  Top 0.305: U$7.C1 31.1,69.5 30.8,69.8 30.8,73.55 31.05,73.8 34.92,73.8 35.67,73.05 35.67,62.17 35.05,61.55 35.05,59.92 35.72,59.25 IC2.21
L2_G
  Top 0.305: U$7.C2 33.92,70.8 33.92,63.05 33.42,62.55 33.42,59.42 34.9,57.95 IC2.23
L2_R
  Top 0.305: U$7.C3 34.5,72.1 34.8,71.8 34.8,62.55 34.3,62.05 34.3,59.67 35.38,58.6 IC2.22
L3_B
  Top 0.305: U$1.C1 47.22,72.1 46.55,71.42 46.55,59.92 45.88,59.25 IC2.18
L3_G
  Top 0.305: U$1.C2 50.3,70.8 50.8,70.3 50.8,68.17 50.55,67.92 48.8,67.92 48.17,67.3 48.17,59.3 46.82,57.95 IC2.16
L3_R
  Top 0.305: U$1.C3 47.75,69.5 47.3,69.05 47.3,59.67 46.22,58.6 IC2.17
L4_B
  Top 0.305: U$3.C1 67.35,72.1 66.67,71.42 66.67,66.17 60.55,60.05 50.05,60.05 47.3,57.3 IC2.15
L4_G
  Top 0.305: U$3.C2 70.42,70.8 70.8,70.42 70.8,68.42 70.3,67.92 69.17,67.92 68.3,67.05 68.3,65.55 61.17,58.42 50.8,58.42 48.38,56 IC2.13
L4_R
  Top 0.305: U$3.C3 67.88,69.5 67.42,69.05 67.42,65.67 61.05,59.3 50.55,59.3 47.9,56.65 IC2.14
L5_B
  Top 0.305: U$2.C1 11.23,49.5 10.8,49.92 10.8,54.17 16.23,59.6 24.9,59.6 29.15,55.35 IC2.27
L5_G
  Top 0.305: IC2.29 27.75,54.05 23.9,57.9 16.9,57.9 14,55 14,50.8 U$2.C2
L5_R
  Top 0.305: IC2.28 28.6,54.7 24.5,58.8 16.6,58.8 12.4,54.6 U$2.C3
L6_B
  Top 0.305: U$10.C1 31.1,49.5 30.8,49.8 30.8,52.92 31.28,53.4 IC2.30
L6_G
  Top 0.305: U$10.C2 33.55,50.8 34.85,52.1 IC2.32
L6_R
  Top 0.305: U$10.C3 33.85,52.1 34.5,52.75 IC2.31
L7_B
  Top 0.305: U$6.C1 49.2,52.9 48.7,53.4 IC2.9
L7_G
  Top 0.305: U$6.C2 47.67,50.8 46.38,52.1 IC2.7
L7_R  (via drill 0.4)
  Top 0.305: U$6.C3 50.5,49.5 50.8,49.8 v50.8,53.3 | v47.42,52.42 47.1,52.75 IC2.8
  Bottom 0.305: v50.8,53.3 48.3,53.3 v47.42,52.42
L8_B
  Top 0.305: U$9.C1 69.2,53.27 65.05,57.42 51.05,57.42 48.97,55.35 IC2.12
L8_G
  Top 0.305: U$9.C2 70.42,50.8 70.8,50.42 70.8,48.42 70.42,48.05 67.17,48.05 66.17,49.05 66.17,51.8 62.17,55.8 51.55,55.8 49.8,54.05 IC2.10
L8_R
  Top 0.305: U$9.C3 67.35,49.5 66.92,49.92 66.92,52.3 62.55,56.67 51.3,56.67 49.32,54.7 IC2.11
L9_B
  Top 0.305: U$14.C1 14.25,29.5 14.3,29.55 17.85,26 IC3.12
L9_G
  Top 0.305: U$14.C2 11.18,30.8 10.8,31.18 10.8,33.05 11.05,33.3 14.55,33.3 20.55,27.3 IC3.10
L9_R
  Top 0.305: U$14.C3 14.5,32.1 19.95,26.65 IC3.11
L10_B
  Top 0.305: IC3.9 32.9,27.95 32.4,28.45 U$13.C1
L10_G
  Top 0.305: IC3.7 35.8,29.25 34.88,30.18 34.67,30.43 34.3,30.8 U$13.C2
L10_R  (via drill 0.4)
  Top 0.305: IC3.8 34.88,28.6 v34.3,29.18 | v31.05,33.42 31.8,33.42 32.3,32.92 32.3,32.2 U$13.C3
  Bottom 0.305: v34.3,29.18 32.17,29.18 30.93,30.43 30.93,33.3 v31.05,33.42
L11_B
  Top 0.305: U$12.C1 50.5,32.1 50.8,31.8 50.8,28.55 50.2,27.95 IC3.30
L11_G
  Top 0.305: U$12.C2 47.8,30.8 47.8,29.68 47.38,29.25 IC3.32
L11_R
  Top 0.305: U$12.C3 48.3,28.6 IC3.31
L12_B
  Top 0.305: U$5.C1 70.5,32.1 70.8,31.8 70.8,28.3 70.3,27.8 63.92,27.8 62.12,26 IC3.27
L12_G
  Top 0.305: U$5.C2 64.05,30.8 60.55,27.3 IC3.29
L12_R
  Top 0.305: U$5.C3 64.12,29.5 61.27,26.65 IC3.28
L13_B
  Top 0.305: IC3.15 25.73,24.05 14.88,13.2 14.88,10.18 14.2,9.5 U$11.C1
L13_G
  Top 0.305: U$11.C2 11.3,10.8 10.8,11.3 10.8,13.18 12.08,14.45 13.12,14.45 24.03,25.35 IC3.13
L13_R
  Top 0.305: IC3.14 25.07,24.7 13.65,13.28 12.78,13.28 12.4,12.9 U$11.C3
L14_B
  Top 0.305: U$15.C1 34.17,9.5 34.7,10.03 34.7,11.45 34.38,11.78 34.38,20.5 35.97,22.1 IC3.18
L14_G
  Top 0.305: U$15.C2 31.18,10.8 30.8,11.18 30.8,13.12 32.42,14.75 32.42,20.55 35.27,23.4 IC3.16
L14_R
  Top 0.305: IC3.17 35.62,22.75 33.3,20.43 33.3,13.85 33.02,13.58 32.67,13.58 32.4,13.3 U$15.C3
L15_B
  Top 0.305: U$16.C1 50.5,12.1 50.8,11.8 50.8,8.43 50.17,7.8 46.92,7.8 46.17,8.55 46.17,21.8 45.88,22.1 IC3.21
L15_G
  Top 0.305: U$16.C2 47.8,10.93 47.8,22.68 47.07,23.4 IC3.23
L15_R
  Top 0.305: U$16.C3 47.22,9.5 46.92,9.8 46.92,22.43 46.6,22.75 IC3.22
L16_B
  Top 0.305: U$4.C1 70.38,12.1 70.8,11.68 70.8,8.3 70.42,7.92 67.27,7.92 65.55,9.65 65.55,19.75 65.55,21.85 63.35,24.05 IC3.24
L16_G
  Top 0.305: U$4.C2 67.67,10.8 67.3,10.8 67,11.1 67,16 67.2,16.2 67.6,16.6 70.4,19.4 70.4,23.4 68.45,25.35 65.05,25.35 IC3.26
L16_R
  Top 0.305: U$4.C3 67.22,9.5 66.2,10.53 66.2,20.1 66.2,22.8 64.3,24.7 IC3.25
MISO  (via drill 0.4)
  Top 0.305: IC3.19 37.07,21.43 37.07,20.48 v36.07,19.48 | v20.8,16.8 23.98,19.98 v29.28,19.98 | IC1.2 17.8,37.6 17.4,37.2 17.4,36.6 v17,36.2
  Bottom 0.305: v36.07,19.48 29.78,19.48 v29.28,19.98 | v17,36.2 20.8,32.4 v20.8,16.8
MOSI  (via drill 0.4)
  Top 0.305: IC2.1 44.42,48.12 44.42,47.3 44.3,47.3 43.8,46.8 43.3,46.8 v42.05,45.55 | v38.67,42.67 38.57,42.57 31.78,42.57 28.95,45.4 v28.8,45.4 | v15.8,38.6 IC1.1
  Bottom 0.305: v38.67,42.67 38.67,43.3 40.92,45.55 v42.05,45.55 | v28.8,45.4 29.8,46.4 29.8,47.5 29.1,48.2 22.6,48.2 19,44.6 19,42.6 18.4,42 18,42 15.8,39.8 v15.8,38.6
N$1  (via drill 0.4)
  Top 0.305: v59.67,12.18 60.8,13.3 IC6.16
  Bottom 0.305: v59.67,12.18 63.17,12.18 66.88,8.47 X2.D-
N$2  (via drill 0.4)
  Top 0.406: v15.9,50.2 IC1.33
  Bottom 0.406: 12.9,61.55 S2.1 | 12.9,61.55 S2.2 | v15.9,50.2 12.9,50.2 12.9,61.55
N$3  (via drill 0.4)
  Top 0.305: v62.77,10.18 62.03,10.92 IC6.15
  Bottom 0.305: X2.D+ 65.27,7.67 v62.77,10.18
N$4
  Top 0.305: IC1.29 20.2,51.2 20.3,51.3 C16.2
N$5
  Top 0.305: IC1.27 21.8,52.2 L2.2 C18.1
N$7  (via drill 0.4)
  Top 0.305: IC1.32 17.8,51.5 17.1,52.2 v16.1,52.2
  Bottom 0.406: S1.3 S1.4 7.85,68.55 7.4,68.1 7.4,64.6 8.9,63.1 17.7,63 18.8,61.9 18.8,61 18.1,60.3 15.6,60.3 14.2,58.9 14.2,53 15,52.2 v16.1,52.2
N$9  (via drill 0.4)
  Top 0.305: IC3.1 37.1,34 37.47,34.38 42.97,34.38 v43.27,34.67 | IC2.19 44.5,60.75 44.88,61.12 v44.88,68.38 | v48.17,44.38 47.38,44.38 44.77,41.77 v44.77,40.67
  Bottom 0.305: v43.27,34.67 44.77,36.17 v44.77,40.67 | v48.17,44.38 48.88,46.17 48.88,47.27 48.88,48.07 48.88,48.77 51.77,51.67 51.77,54.27 51.17,54.88 49.17,54.88 47.38,56.67 47.38,66.38 46.27,67.47 45.77,67.47 v44.88,68.38
N$10
  Top 0.406: IC4.7 68.91,45.06 | R6.2 70.62,44.95
  Top 0.61: 68.91,45.06 R6.2 | 70.62,44.95 R5.1
N$11  (via drill 0.4)
  Top 0.305: IC3.34 46.67,30.55 v46.67,30.3 | R3.1 44.6,18.8 v44.6,20.03
  Bottom 0.305: v46.67,30.3 46.65,30.2 46.67,26.78 46.67,25.28 44.6,23.2 v44.6,20.03
N$12  (via drill 0.4)
  Top 0.305: IC2.34 35.3,50.8 v35.3,51.05 | v32.42,58.42 31.8,59.05 R2.1
  Bottom 0.305: v35.3,51.05 32.42,54.05 v32.42,58.42
N$14
  Bottom 0.305: PAD1.1 19,57.9 18.7,57.6 18.7,55.35 17.9,54.55 S3.2
  Bottom 0.406: S3.2 16.75,53.65 17.4,53 17.5,50 16.4,48.9 12.3,48.9 11.7,49.5 11.7,53.6 10.75,54.55 S3.1
N$15  (via drill 0.4)
  Top 0.305: IC1.31 v18.6,53
  Bottom 0.305: v18.6,53 18.6,53.9 19.2,54.5 PAD2.1
N$16  (via drill 0.4)
  Top 0.305: IC1.30 19.4,48.5 v19.3,48.4 | v23.3,60.9 20.7,60.9 19.2,60.9 | 19.2,60.9 18.3,60.9 | 18.3,60.9 16.9,60.9 R8.1 | 18.3,60.9 R7.2 | 19.2,60.9 18.3,60.9
  Bottom 0.305: v19.3,48.4 19.3,49.9 22.9,53.5 22.9,55.5 22.9,60.5 v23.3,60.9
N$29
  Top 0.305: IC6.17 57.77,13.95 C14.1
N$30
  Top 0.305: Q1.3 22.25,35.03 | Q1.3 20.73,34.77 C5.2 | Q1.3 22.28,35.05 | IC1.7 21.8,36.4 22,36.2 Q1.3
N$32
  Top 0.305: Q1.1 23.98,32.97 24.98,33.97 24.98,34.5 C6.2 24.98,35.82 24.7,36.1 23,36.1 22.6,36.5 IC1.8
N$56
  Top 0.406: IC4.8 69.43,46.33
  Top 0.61: 69.43,46.33 C9.1
N$57  (via drill 0.8)
  Top 0.406: 63.2,44.2 C10.2
  Top 0.61: 63.2,44.2 62.79,43.79 IC4.3 57.89,43.79 D2.C
  Top 1.27: 57.57,44.06 D2.C
  Top 1.422: v57.57,40.77 57.57,44.06
  Bottom 1.27: L1.1 57.57,38.47
  Bottom 1.422: 57.57,38.47 v57.57,40.77 v57.57,41.97
N$58
  Top 0.406: 61.4,46.4 C10.1 D1.1
  Top 0.61: IC4.1 61.4,46.4
RST
  Top 0.305: IC1.4 19.4,36.17 R1.1
RXD  (via drill 0.4)
  Top 0.305: IC6.1 53.1,21.1 v52.67,20.68 | v23.6,40.6 23.4,40.4 IC1.9
  Bottom 0.305: v52.67,20.68 52.67,19.78 51.38,18.48 51.38,10.68 49.38,8.68 26.28,8.68 23.48,11.48 23.48,40.47 v23.6,40.6
RXD1  (1 unrouted)
SCK  (via drill 0.4)
  Top 0.305: IC2.2 45.88,48.85 46.17,48.55 46.17,47.3 43.8,44.92 43.42,44.92 41.42,42.92 v40.67,42.92 39.55,44.05 38.35,44.05 37.77,43.47 32.17,43.47 28.75,46.9 v28.6,46.9 | IC3.2 35.85,32.5 35.55,32.8 35.55,35.05 35.92,35.42 40.3,35.42 v41.55,36.67 | IC1.3 v18.6,40.8
  Bottom 0.305: v40.67,42.92 40.17,42.42 40.17,38.05 v41.55,36.67 | v18.6,40.8 20,42.2 20,44.5 22.9,47.4 28.1,47.4 v28.6,46.9
TXD  (via drill 0.4)
  Top 0.305: IC6.5 53.2,18.5 v52.67,17.98 | IC1.10 24.2,39.8 24.8,40.4 24.8,41.2 24.2,41.8 23.2,41.8 22.2,40.8 v22.2,40.6
  Bottom 0.305: v52.67,17.98 52.67,10.28 49.97,7.58 25.68,7.58 22.28,10.98 22.28,40.67 v22.2,40.6
TXD1  (1 unrouted)
VCC_R  (via drill 0.5, 0.6, 0.8)
  Top 0.305: v75.92,49.42 75.92,49.5 | v6.05,12.05 6.05,12.1 | v6.05,32.05 6.05,32.1 | v6.05,52.05 6.05,52.1 | v6.05,72.05 6.05,72.1 | 29.2,72.05 U$7.A3 | U$10.A3 29.2,51.92 | U$15.A3 29.2,12.05 | 52.42,9.48 U$16.A3 | v54.55,29.43 54.55,29.5 | R5.2 74.2,44.8 v75.92,43.07
  Top 0.406: U$4.A1 72.8,12.1 U$4.A2 72.4,10.8 U$4.A3 | U$16.A1 52.8,12.1 U$16.A2 52.4,10.8 U$16.A3 | U$15.A1 28.8,9.5 U$15.A2 29.2,10.8 U$15.A3 | U$11.A3 8.8,12.1 U$11.A2 9.2,10.8 U$11.A1 | U$13.A3 28.8,32.1 U$13.A2 29.2,30.8 U$13.A1 | 52.4,30.8 U$12.A1 | 52.4,30.8 U$12.A2 | U$12.A3 52.4,30.8 | U$5.A1 72.8,32.1 U$5.A2 72.4,30.8 U$5.A3 | U$9.A1 72.8,52.1 U$9.A2 72.4,50.8 U$9.A3 | U$6.A1 52.8,52.1 U$6.A2 52.4,50.8 U$6.A3 | 29.2,51.92 28.8,51.92 U$10.A2 29.2,50.8 U$10.A1 | U$2.A3 8.8,52.1 U$2.A2 9.2,50.8 U$2.A1 | U$8.A3 8.8,72.1 U$8.A2 9.2,70.8 U$8.A1 | U$1.A1 52.8,72.1 U$1.A2 52.4,70.8 U$1.A3 | U$3.A1 72.8,72.1 U$3.A2 72.4,70.8 U$3.A3 | U$14.A3 8.8,32.1 U$14.A2 9.2,30.8 U$14.A1 | U$7.A1 28.8,69.5 U$7.A2 28.8,72.05 29.2,72.05 | IC4.4 64.42,42.52 64.42,49.92 D1.2
  Top 0.5: 75.92,49.5 U$9.A3 | 6.05,12.1 U$11.A3 | 6.05,32.1 U$14.A3 | 6.05,52.1 U$2.A3 | 6.05,72.1 U$8.A3 | v27.18,72.05 29.2,72.05 | v52.42,6.3 52.42,9.48 | 54.55,29.5 U$12.A3 | U$3.A3 75.92,69.5 v75.92,69.3 | v27.18,52.92 28,52.1 U$10.A3 | U$5.A3 74.77,29.5 v75.42,28.9 | v25.18,16.02 28.23,16.02 29.2,15.05 U$15.A3 | U$4.A1 72.4,14.18 v75.97,14.18 | v25.18,28.93 28.62,28.93 U$13.A1 | v53.88,54.07 52.4,52.6 U$6.A1 | 52.8,72.1 53.88,73.17 53.88,73.47 v54.8,74.4
  Top 0.61: IC4.4 61.42,42.42
  Top 0.813: 61.42,42.42 61.42,41.8 | v25.18,16.02 23.6,14.45 v23.6,7.2
  Top 1.27: v70.58,39.77 70.58,39.4 C8.+
  Bottom 0.5: 54.55,6.3 v54.55,29.43 | v75.97,14.18 75.47,14.18 71.27,14.08 | v53.88,54.07 53.88,75.3 54.2,75.3 | v54.8,74.4 54.8,75.1 55,75.3
  Bottom 0.813: 75.92,28.93 v75.92,43.07 v75.92,49.42 v75.92,69.3 75.92,75.3 55,75.3 54.2,75.3 27.18,75.3 | 23.6,6.3 6.05,6.3 v6.05,12.05 v6.05,32.05 v6.05,52.05 v6.05,72.05 6.05,75.3 22.4,75.3 | 23.6,6.3 v52.42,6.3 54.55,6.3 57.88,9.62 57.88,13.58 58.38,14.08 71.27,14.08 75.08,14.08 75.08,16.07 76.88,16.07 76.88,28.93 75.92,28.93 | 27.18,75.3 v27.18,72.05 v27.18,52.92 | 22.4,75.3 27.18,75.3 | 75.92,28.93 v75.42,28.9 | 23.6,6.3 v23.6,7.2 | v25.18,16.02 v25.18,28.93 | PAD10.1 22.3,75.2 22.4,75.3
  Bottom 1.27: v63.88,38.47 L1.2 69.27,38.47 v70.58,39.77 v73.58,39.77 | v73.58,39.77 | v73.58,39.77 75.98,39.77
  other vias: 65.58,38.47 75.92,39.77
  pour Top (isolate 0.61): 60.8,36.67 60.8,42.55 64.55,42.55 64.55,40.55 72.38,40.57 72.38,44.97 76.5,44.95 76.47,36.67
XLAT  (via drill 0.4)
  Top 0.305: IC2.3 46.35,49.5 46.92,48.92 46.92,47.05 v41.92,42.05 41.55,41.67 31.38,41.67 30.45,42.6 29.2,42.6 28.6,42 IC1.14 | IC3.3 35.5,31.85 34.8,32.55 34.8,35.92 35.3,36.42 39.55,36.42 41.3,38.17 v41.92,38.17
  Bottom 0.305: v41.92,38.17 v41.92,42.05

### Text on the board
tPlace: Pentawall | seb@exse.net | Mini